# EAGLE schematic pi-7 (EAGLE 7.6.0)
CNAME: Dash7 Raspberry Pi HAT; CREVISION: 1.0; DESIGNER: Christophe VG
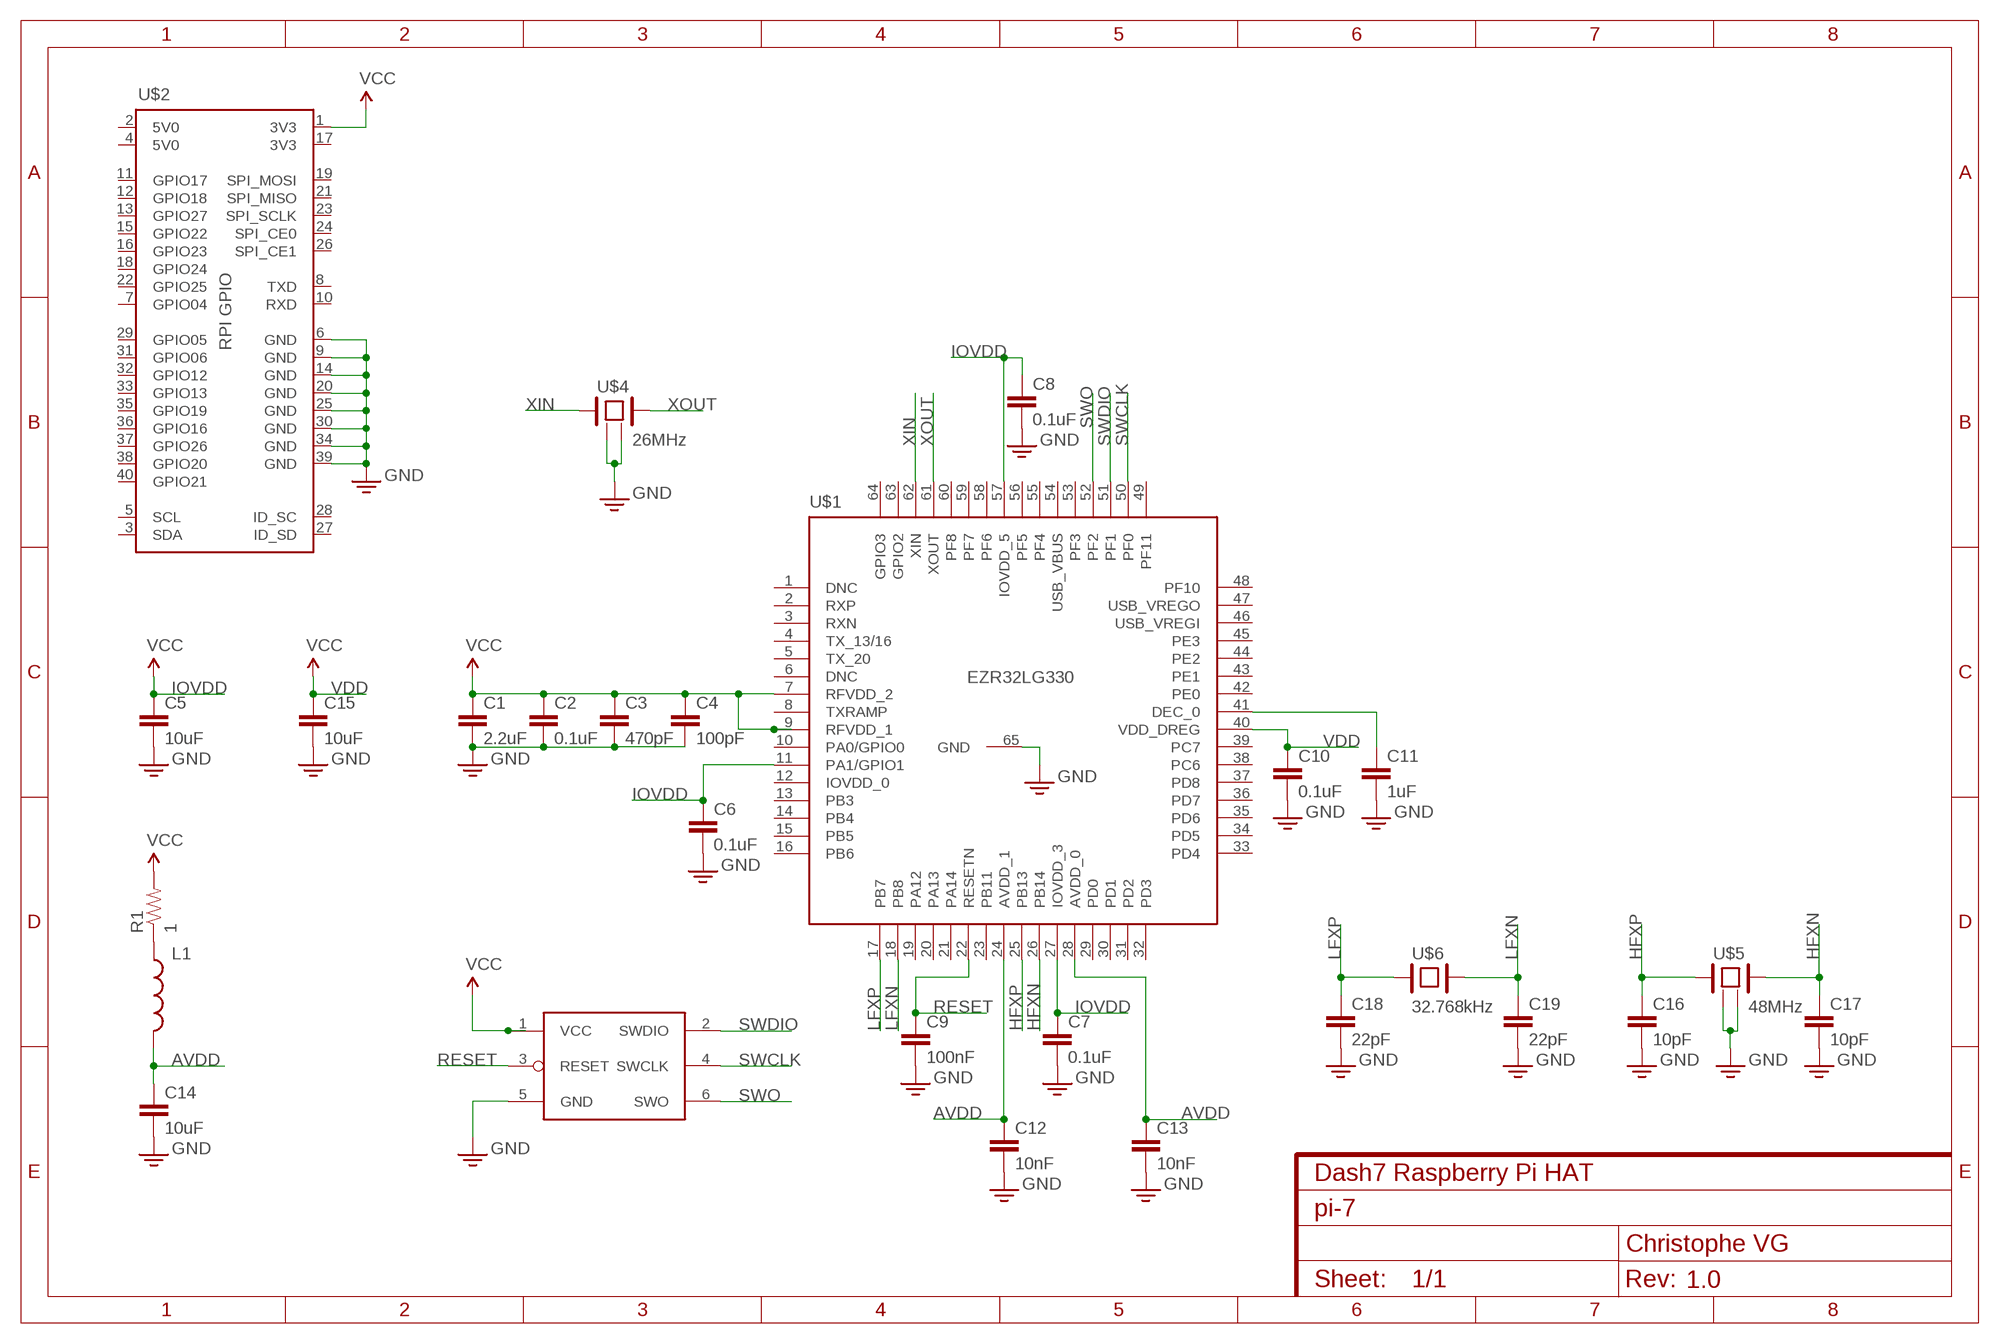
[diagram p0: schematic, sheet 1]

## Parts
C1  2.2uF  CAP0805  [0805]
C2  0.1uF  CAP0805  [0805]
C3  470pF  CAP0805  [0805]
C4  100pF  CAP0805  [0805]
C5  10uF  CAP0805  [0805]
C6  0.1uF  CAP0805  [0805]
C7  0.1uF  CAP0805  [0805]
C8  0.1uF  CAP0805  [0805]
C9  100nF  CAP0805  [0805]
C10  0.1uF  CAP0805  [0805]
C11  1uF  CAP0805  [0805]
C12  10nF  CAP0805  [0805]
C13  10nF  CAP0805  [0805]
C14  10uF  CAP0805  [0805]
C15  10uF  CAP0805  [0805]
C16  10pF  CAP0805  [0805]
C17  10pF  CAP0805  [0805]
C18  22pF  CAP0805  [0805]
C19  22pF  CAP0805  [0805]
L1  INDUCTOR0805  [0805]
R1  1  RESISTOR0805-RES  [0805]
U$1  EZR32LG330  [QFN64G-0.5-9X9MM]
U$2  RPI3_HAT  [RASPI_BOARD_B+HAT_DF_CF]
U$3  JTAG-6PINS  [TC2030-IDC]
U$4  26MHz  ABM8  [ABM8]
U$5  48MHz  ABM11  [ABM11]
U$6  32.768kHz  MS3V-T1R  [MS3V-T1R]

## Nets
AVDD: C12.1 C13.1 C14.1 L1.2 U$1.24(AVDD_1) U$1.28(AVDD_0)
GND-ISO: C1.2 C2.2 C3.2 C4.2 C5.2 C6.2 C7.2 C8.2 C9.2 C10.2 C11.2 C12.2 C13.2 C14.2 C15.2 C16.2 C17.2 C18.2 C19.2 U$1.65(GND) U$2.6(GND) U$2.9(GND) U$2.14(GND) U$2.20(GND) U$2.25(GND) U$2.30(GND) U$2.34(GND) U$2.39(GND) U$3.5(GND) U$4.2(GND) U$4.4(GND) U$5.2(GND) U$5.4(GND) ; supply symbol labelled GND
HFXN: C17.1 U$1.26(PB14) U$5.3
HFXP: C16.1 U$1.25(PB13) U$5.1
IOVDD: C5.1 C6.1 C7.1 C8.1 U$1.11(PA1/GPIO1) U$1.27(IOVDD_3) U$1.57(IOVDD_5) ; supply symbol labelled VCC
LFXN: C19.1 U$1.18(PB8) U$6.2
LFXP: C18.1 U$1.17(PB7) U$6.1
N$2: C11.1 U$1.41(DEC_0)
N$4: L1.1 R1.1
RESET: C9.1 U$1.22(RESETN) U$3.3(RESET)
SWCLK: U$1.50(PF0) U$3.4(SWCLK)
SWDIO: U$1.51(PF1) U$3.2(SWDIO)
SWO: U$1.52(PF2) U$3.6(SWO)
VCC: C1.1 C2.1 C3.1 C4.1 R1.2 U$1.7(RFVDD_2) U$1.9(RFVDD_1) U$2.1(3V3) U$3.1(VCC)
VDD: C10.1 C15.1 U$1.40(VDD_DREG) ; supply symbol labelled VCC
XIN: U$1.62(XIN) U$4.1
XOUT: U$1.61(XOUT) U$4.3
Unconnected: U$1.1(DNC) U$1.2(RXP) U$1.3(RXN) U$1.4(TX_13/16) U$1.5(TX_20) U$1.6(DNC) U$1.8(TXRAMP) U$1.10(PA0/GPIO0) U$1.12(IOVDD_0) U$1.13(PB3) U$1.14(PB4) U$1.15(PB5) U$1.16(PB6) U$1.19(PA12) U$1.20(PA13) U$1.21(PA14) U$1.23(PB11) U$1.29(PD0) U$1.30(PD1) U$1.31(PD2) U$1.32(PD3) U$1.33(PD4) U$1.34(PD5) U$1.35(PD6) U$1.36(PD7) U$1.37(PD8) U$1.38(PC6) U$1.39(PC7) U$1.42(PE0) U$1.43(PE1) U$1.44(PE2) U$1.45(PE3) U$1.46(USB_VREGI) U$1.47(USB_VREGO) U$1.48(PF10) U$1.49(PF11) U$1.53(PF3) U$1.54(USB_VBUS) U$1.55(PF4) U$1.56(PF5) U$1.58(PF6) U$1.59(PF7) U$1.60(PF8) U$1.63(GPIO2) U$1.64(GPIO3) U$2.3(SDA) U$2.5(SCL) U$2.7(GPIO04) U$2.8(TXD) U$2.10(RXD) U$2.11(GPIO17) U$2.12(GPIO18) U$2.13(GPIO27) U$2.15(GPIO22) U$2.16(GPIO23) U$2.18(GPIO24) U$2.19(SPI_MOSI) U$2.21(SPI_MISO) U$2.22(GPIO25) U$2.23(SPI_SCLK) U$2.24(SPI_CE0) U$2.26(SPI_CE1) U$2.27(ID_SD) U$2.28(ID_SC) U$2.29(GPIO05) U$2.31(GPIO06) U$2.32(GPIO12) U$2.33(GPIO13) U$2.35(GPIO19) U$2.36(GPIO16) U$2.37(GPIO26) U$2.38(GPIO20) U$2.40(GPIO21)

## Power pins joined to a net without a drawn wire
3V3: U$2.17(3V3)
5V0: U$2.2(5V0) U$2.4(5V0)

## Library data of the parts
C1-C19 = passive:CAP: Capacitor Standard 0603 ceramic capacitor, and 0.1" leaded capacitor.
L1 = passive:INDUCTOR: Inductors Basic Inductor/Choke - 0603 and 1206. Footprints are not proven and vary greatly between part numbers. INDUCTOR POWER 3.3UH 4.0A SMD 0.197" L x 0.197" W x 0.177" H (5.00mm x 5.00mm x 4.50mm)
R1 = passive:RESISTOR: Resistor Basic schematic elements and footprints for 0603, 1206, and PTH resistors.
U$1 = ezr:EZR32LG330
U$2 = rpi:RPI3_HAT
U$3 = setup:JTAG-6PINS
U$4 = xtal:ABM8
U$5 = xtal:ABM11
U$6 = xtal:MS3V-T1R